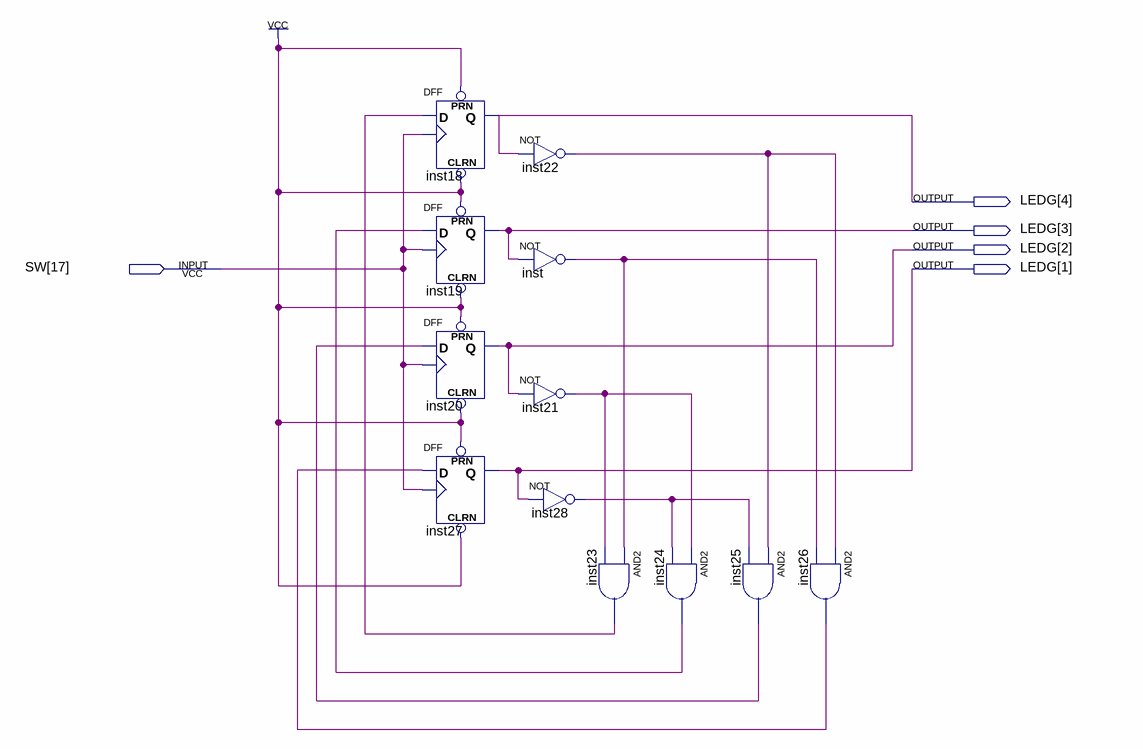
[diagram p0: schematic sheet]
// Quartus schematic dff.bdf as structural Verilog: 12 symbols, 5 pins
module dff (
  input  [17:17] SW,
  output [4:1] LEDG
);

  wire inst21_out, inst22_out, inst23_out, inst24_out, inst25_out, inst26_out, inst28_out, inst_out;

  DFF inst18 (.CLRN(1'b1), .CLK(SW[17]), .D(inst23_out), .PRN(1'b1), .Q(LEDG[4]));
  DFF inst19 (.CLRN(1'b1), .CLK(SW[17]), .D(inst24_out), .PRN(1'b1), .Q(LEDG[3]));
  DFF inst20 (.CLRN(1'b1), .CLK(SW[17]), .D(inst25_out), .PRN(1'b1), .Q(LEDG[2]));
  DFF inst27 (.CLRN(1'b1), .CLK(SW[17]), .D(inst26_out), .PRN(1'b1), .Q(LEDG[1]));
  not inst22 (inst22_out, LEDG[4]);
  not inst (inst_out, LEDG[3]);
  not inst21 (inst21_out, LEDG[2]);
  not inst28 (inst28_out, LEDG[1]);
  and inst23 (inst23_out, inst_out, inst21_out);
  and inst24 (inst24_out, inst21_out, inst28_out);
  and inst25 (inst25_out, inst22_out, inst28_out);
  and inst26 (inst26_out, inst22_out, inst_out);
endmodule
